# Altium schematic sheet Master MicroController Port H.SchDoc: Master Micro Controller Port H Pin Out
size A4; DocumentNumber: 23; SheetNumber: 23; SheetTotal: 54
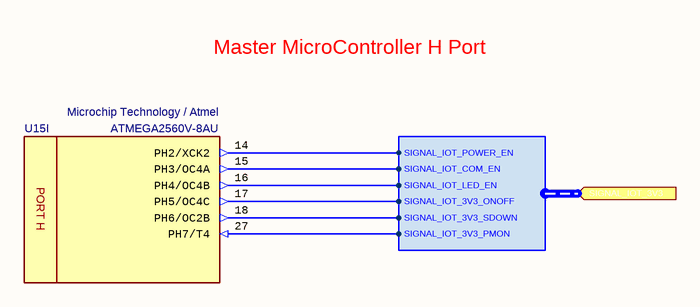
[diagram p0: Master MicroController Port H.SchDoc]

## Parts
U15  Manufacturer_Part_Number: ATMEGA2560V-8AU  Manufacturer_Name: Microchip Technology / Atmel  [TQFP100]  (hidden comment: 8-bit MicroController)  (part I of 15)

## Ports
SIGNAL_IOT_3V3 (in, harness SIGNAL_IOT_3V3)

## Harnesses
SIGNAL_IOT_3V3: SIGNAL_IOT_COM_EN, SIGNAL_IOT_POWER_EN, SIGNAL_IOT_LED_EN, SIGNAL_IOT_3V3_SDOWN, SIGNAL_IOT_3V3_ONOFF, SIGNAL_IOT_3V3_PMON

## Nets
NetU15_14: U15.14(PH2/XCK2) ; port SIGNAL_IOT_3V3.SIGNAL_IOT_POWER_EN
NetU15_15: U15.15(PH3/OC4A) ; port SIGNAL_IOT_3V3.SIGNAL_IOT_COM_EN
NetU15_16: U15.16(PH4/OC4B) ; port SIGNAL_IOT_3V3.SIGNAL_IOT_LED_EN
NetU15_17: U15.17(PH5/OC4C) ; port SIGNAL_IOT_3V3.SIGNAL_IOT_3V3_ONOFF
NetU15_18: U15.18(PH6/OC2B) ; port SIGNAL_IOT_3V3.SIGNAL_IOT_3V3_SDOWN
NetU15_27: U15.27(PH7/T4) ; port SIGNAL_IOT_3V3.SIGNAL_IOT_3V3_PMON

## Notes on the sheet
- Master MicroController H Port
- Engineer
- All Rights are reserved to Customer and Engineer. [2021]
- Size:
- Date:
- A4
- Project :
- Time:
- Sheet
- of
- Customer
- Product ID
- Module ID
- Version
- File:
- Revision
- (in symbol IC - ATMEGA2560V-8AU, part I) PORT H

## Library data of the parts
U15 = IC - ATMEGA2560V-8AU: 8-bit Microcontrollers - MCU 256kB Flash 4kB EEPROM 86 I/O Pins; Supply Voltage - Min: 2V7; Supply Voltage - Max: 5.5V; Height: 1mm; Mouser_Part_Number: 556-ATMEGA2560V8AU; ComponentLink1Description: DataSheet; ComponentLink1URL: https://eu.mouser.com/datasheet/2/268/Atmel-2549-8-bit-AVR-Microcontroller-ATmega640-128-1315286.pdf; ROHS: Yes; Minimum Operating Temperature: -40; Maximum Operating Temperature: +85; ComponentLink2Description: Mouser; ComponentLink2URL: https://eu.mouser.com/ProductDetail/Microchip-Technology-Atmel/ATMEGA2560V-8AU?qs=sGAEpiMZZMutXGli8Ay4kKlCYcvZUWqJYdtgGFyqFT8%3D; Supplier 1: Mouser; Supplier 2: Arrow; Supplier 3: Farnell; Supplier 4: Newark; Supplier 5: Digi-Key; Supplier Part Number 1: 556-ATMEGA2560V8AU; Supplier Part Number 2: ATMEGA2560V-8AU; Supplier Part Number 3: 1288331; Supplier Part Number 4: 68T2784; Supplier Part Number 5: ATMEGA2560V-8AU-ND; Case: TQFP-100